# Altium schematic sheet MPPT_Measurements.SchDoc
size C
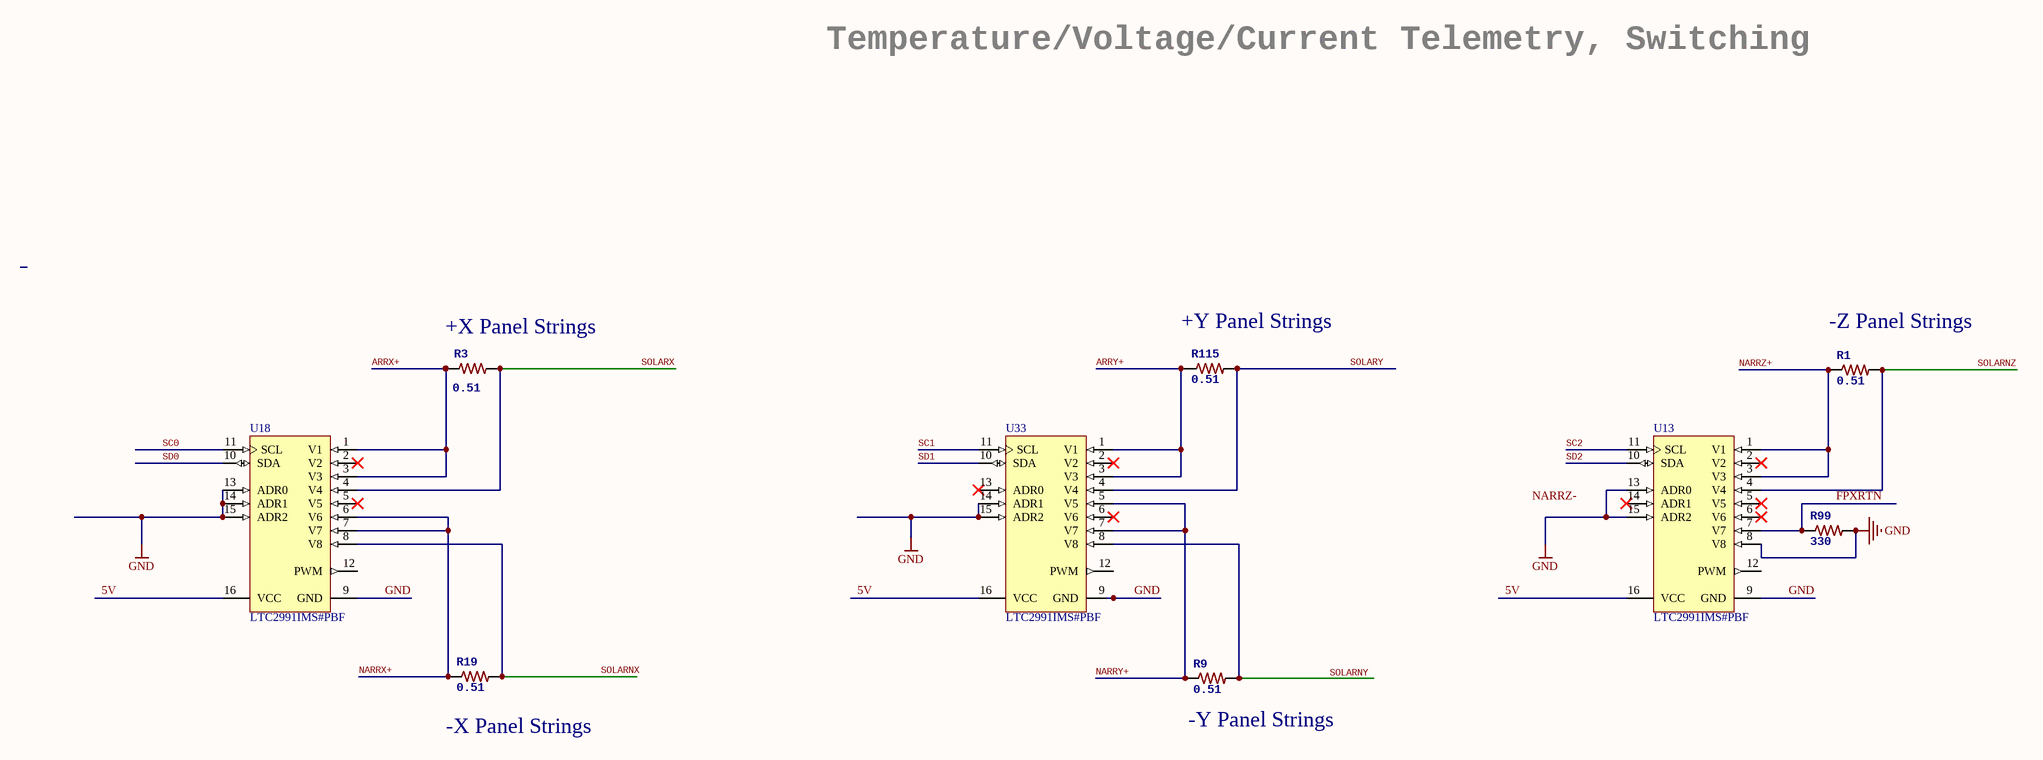
[diagram p0: MPPT_Measurements.SchDoc]

## Parts
R1  0.51  [RESC1220X06N]
R3  0.51  [RESC1220X06N]
R9  0.51  [RESC1220X06N]
R19  0.51  [RESC1220X06N]
R99  330  [0603-RES]
R115  0.51  [RESC1220X06N]
U13  LTC2991IMS#PBF  [LT-MS-16_N]
U18  LTC2991IMS#PBF  [LT-MS-16_N]
U33  LTC2991IMS#PBF  [LT-MS-16_N]

## Nets
GND: R99.2 U13.8(V8) U13.9(GND) U13.13(ADR0) U13.15(ADR2) U18.9(GND) U18.13(ADR0) U18.14(ADR1) U18.15(ADR2) U33.9(GND) U33.14(ADR1) U33.15(ADR2)
5V: U13.16(VCC) U18.16(VCC) U33.16(VCC)
ARRX+: R3.1 U18.1(V1) U18.3(V3)
ARRY+: R115.1 U33.1(V1) U33.3(V3)
FPXRTN: R99.1 U13.7(V7)
NARRX+: R19.1 U18.6(V6) U18.7(V7)
NARRY+: R9.1 U33.5(V5) U33.7(V7)
NARRZ+: R1.1 U13.1(V1) U13.3(V3)
SC0: U18.11(SCL)
SC1: U33.11(SCL)
SC2: U13.11(SCL)
SD0: U18.10(SDA)
SD1: U33.10(SDA)
SD2: U13.10(SDA)
SOLARNX: R19.2 U18.8(V8)
SOLARNZ: R1.2 U13.4(V4)
SOLARX: R3.2 U18.4(V4)
SOLARY: R115.2 U33.4(V4)
NetR9_2: R9.2 U33.8(V8)

Not connected (* = marked no-connect by the designer): U13 2(V2)* 5(V5)* 6(V6)* 12(PWM) 14(ADR1)*; U18 2(V2)* 5(V5)* 12(PWM); U33 2(V2)* 6(V6)* 12(PWM) 13(ADR0)*

## Notes on the sheet
- Temperature/Voltage/Current Telemetry, Switching
- (near R3) +X Panel Strings
- (near R115) +Y Panel Strings
- (near R1) -Z Panel Strings
- (near R19) -X Panel Strings
- (near R9) -Y Panel Strings
- Labels drawn without touching a wire or pin: NARRZ-, SOLARNY

## Library data of the parts
R1 R9 R19 R115 = RESISTOR: <b>Resistor</b> / Basic schematic elements and footprints for 0603, 1206, and PTH resistors.; Supplier 1: Digi-Key; Supplier Part Number 1: RHM.51BSTR-ND; Value: 0.51
R3 = RESISTOR: <b>Resistor</b> / Basic schematic elements and footprints for 0603, 1206, and PTH resistors.; pin to pad: A1 A2 A3>P2 B1 B2 B3>P1; Supplier 1: Digi-Key; Supplier Part Number 1: RHM.51BSTR-ND; Value: 0.51
R99 = RESISTOR0805-RES_333: Manufacturer: TE Connectivity; Manufacturer Part Number: 1625856-2; Tolerance: ±10%; Power (Watts): 0.125W, 1/8W; Temperature Coefficient: ±100ppm/°C; RoHS: RoHS Compliant; Category: Resistors; Packaging: Cut Tape (CT); Value: 330; Composition: Thick Film; Features: -; Operating Temperature: -55°C ~ 125°C; Package / Case: 0805 (2012 Metric); Supplier Device Package: 0805; Size / Dimension: 0.079" L x 0.047" W (2.00mm x 1.20mm); Height: 0.020" (0.50mm); Number of Terminations: 2; ComponentLink1URL: http://www.te.com/commerce/DocumentDelivery/DDEController?Action=srchrtrv&DocNm=1625856&DocType=Customer+Drawing&DocLang=English; ComponentLink1Description: http://www.te.com/commerce/DocumentDelivery/DDEController?Action=srchrtrv&DocNm=1625856&DocType=Customer+Drawing&DocLang=English; Supplier 1: Digi-Key; Supplier Part Number 1: P332DBCT-ND
U13 U18 U33 = CMP-0482-00817-1: Octal I2C Voltage, Current, and Temperature Monitor, 16-pin SOP (MS-16), -40 to 85 degC, Pb-Free; Manufacturer: Linear Technology; Number of Supplies(#): 8; PackageDescription: 16-Pin Plastic MSOP, Body 4.04 x 3.00 mm, Pitch 0.50 mm; ComponentLink3Description: Package Specification; RoHS: TRUE; ComponentLink1URL: http://www.linear.com/; DatasheetVersion: Rev. B; ComponentLink1Description: Manufacturer URL; ComponentLink2Description: Datasheet; ComponentLink2URL: http://cds.linear.com/docs/en/datasheet/2991fb.pdf; PackageReference: MS16; PartNumber: LTC2991IMS#PBF; PackageVersion: Rev. Ø, 06/2010; ComponentLink3URL: http://cds.linear.com/docs/en/packaging/05081669_A_MS16.pdf; Mounting Technology: Surface Mount; Supplier 1: Digi-Key; Supplier Part Number 1: LTC2991IMS#PBF-ND